# Altium schematic sheet CR00045.SchDoc: CR00041
size A4; Organization: Trenz Electronic GmbH; DocumentNumber: CR00041; Revision: 01; SheetNumber: 2; SheetTotal: 2; Date: 2019-11-14; CompanyName: Trenz Electronic GmbH
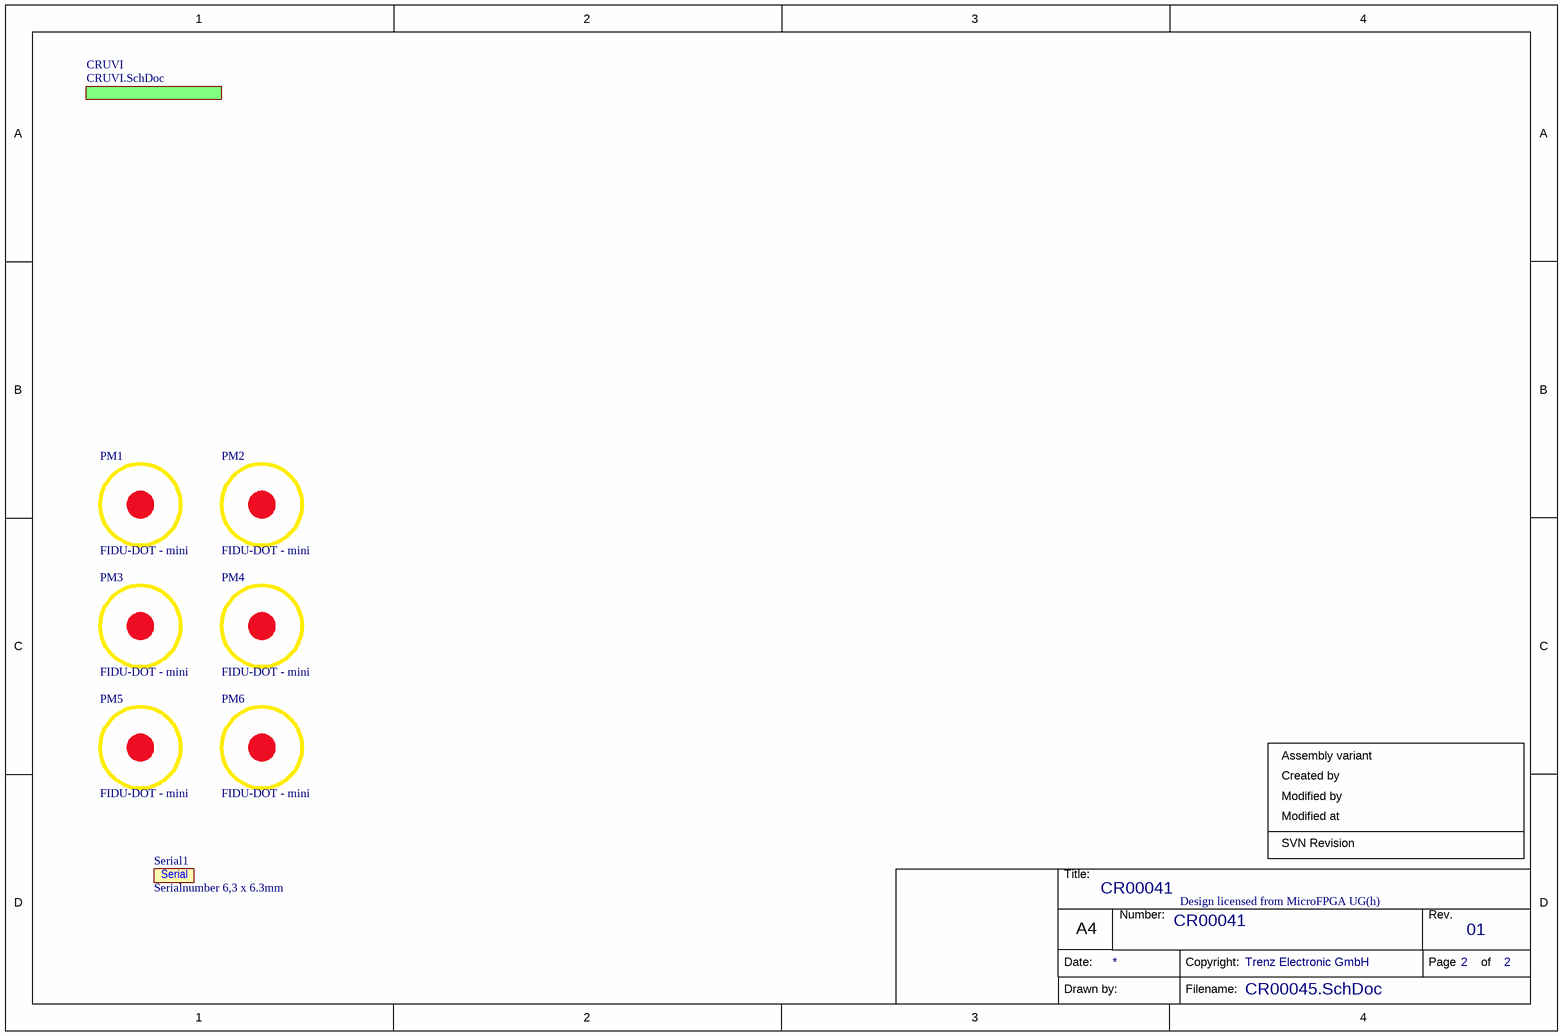
[diagram p0: CR00045.SchDoc]

## Parts
PM1  FIDU-DOT - mini  [FIDU-DOT - mini]
PM2  FIDU-DOT - mini  [FIDU-DOT - mini]
PM3  FIDU-DOT - mini  [FIDU-DOT - mini]
PM4  FIDU-DOT - mini  [FIDU-DOT - mini]
PM5  FIDU-DOT - mini  [FIDU-DOT - mini]
PM6  FIDU-DOT - mini  [FIDU-DOT - mini]
Serial1  Serialnumber 6,3 x 6.3mm  [Serial_6.3x6.3mm]  (no BOM)

## Sub-sheets
CRUVI = CRUVI.SchDoc: no entries

## Notes on the sheet
- Assembly variant
- Created by
- Modified at
- Modified by
- SVN Revision
- Design licensed from MicroFPGA UG(h)
- Title:
- Number:
- Rev.
- Date:
- A4
- Copyright:
- Page
- of
- Drawn by:
- Filename:

## Library data of the parts
PM1-PM6 = 27037: FIDU-DOT - MINI 0.5mm; AN: 27037; Mixed: FIDU
Serial1 = 26753: AN: 26753; Mixed: MECH; H-ART: 39068; Extra: THT-70-718-20